# Altium project TK104_Pulsbegrenser_Eurorack.PrjPCB
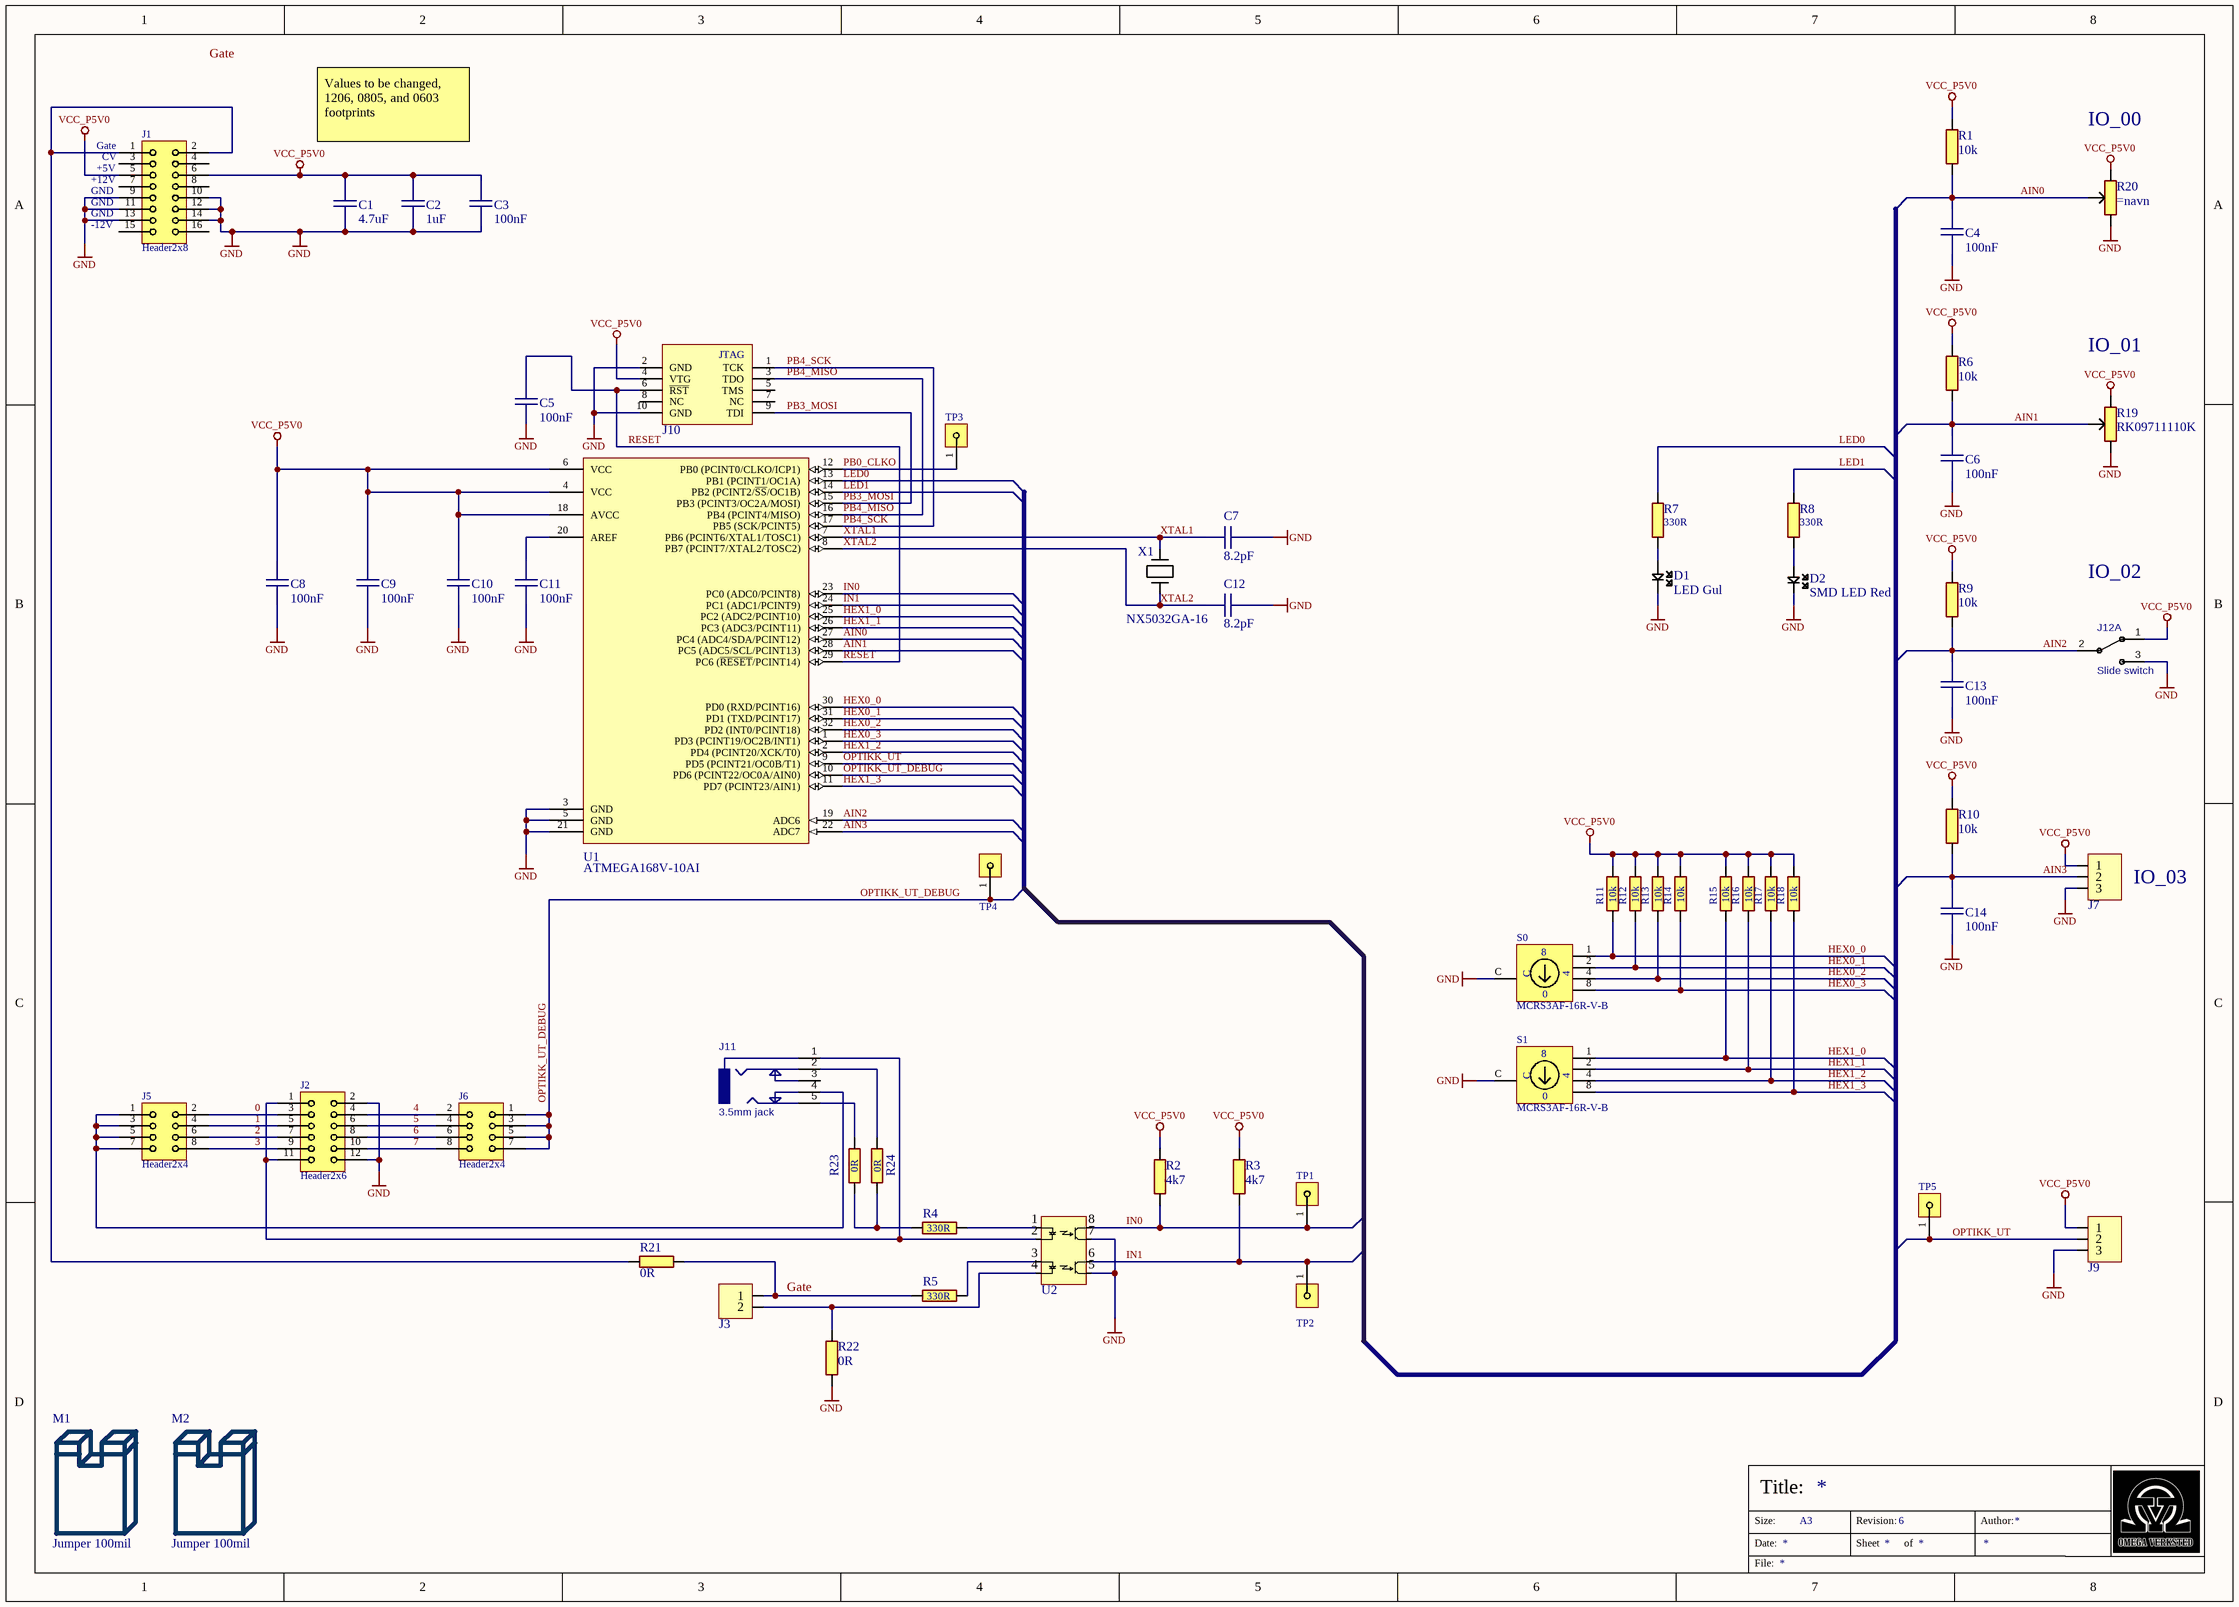
[diagram p0: TK104_Pulsbegrenser_Eurorack.SchDoc]
1 sheet, 62 parts. Net scope: global (net labels, ports and power ports of the same name join across sheets).
Board file: TK104_Pulsbegrenser_Eurorack.PcbDoc

## Sheet TK104_Pulsbegrenser_Eurorack.SchDoc
size A3; Revision: 6

### Parts
C1  4.7uF  [CAPC1206(3216)170_N]
C2  1uF  [CAPC0805(2012)100_N]
C3  100nF  [CAPC0603(1608)55_N]
C4  100nF  [CAPC0603(1608)55_N]
C5  100nF  [CAPC0603(1608)55_N]
C6  100nF  [CAPC0603(1608)55_N]
C7  8.2pF  [CAPC0603(1608)55_N]
C8  100nF  [CAPC0603(1608)55_N]
C9  100nF  [CAPC0603(1608)55_N]
C10  100nF  [CAPC0603(1608)55_N]
C11  100nF  [CAPC0603(1608)55_N]
C12  8.2pF  [CAPC0603(1608)55_N]
C13  100nF  [CAPC0603(1608)55_N]
C14  100nF  [CAPC0603(1608)55_N]
D1  LED Gul  [LED254W7L870D500]
D2  SMD LED Red  [I_LEDC0603(1608)_N]
J1  Header2x8  [HDRV16W64P254_2X8_Shrouded]
J2  Header2x6  [HDRV12W64P254_2X6_RA]
J3  JST 2pin  [JST_2P]  (value not drawn)
J5  Header2x4  [HDRV8W64P254_2X4]
J6  Header2x4  [HDRV8W64P254_2X4]
J7  JST 3pin  [JST_3P]  (value not drawn)
J9  JST 3pin  [JST_3P]  (value not drawn)
J10  Header SMD 127 2x5  [SMDHDRV10P127_2X5_615X330X560B]  (value not drawn)
J11  3.5mm jack  [PJ-306M]
J12  Slide switch  [1MS1T2B4M7RE]  (part A of 2)
M1  Jumper 100mil  [SNT-100-BK-T]
M2  Jumper 100mil  [SNT-100-BK-T]
R1  10k  [RESC0603(1608)_N]
R2  4k7  [RESC0603(1608)_N]
R3  4k7  [RESC0603(1608)_N]
R4  330R  [RESC0603(1608)_N]
R5  330R  [RESC0603(1608)_N]
R6  10k  [RESC0603(1608)_N]
R7  330R  [RESC0603(1608)_N]
R8  330R  [RESC0603(1608)_N]
R9  10k  [RESC0603(1608)_N]
R10  10k  [RESC0603(1608)_N]
R11  10k  [RESC0603(1608)_N]
R12  10k  [RESC0603(1608)_N]
R13  10k  [RESC0603(1608)_N]
R14  10k  [RESC0603(1608)_N]
R15  10k  [RESC0603(1608)_N]
R16  10k  [RESC0603(1608)_N]
R17  10k  [RESC0603(1608)_N]
R18  10k  [RESC0603(1608)_N]
R19  RK09711110K  [RK09711110K]
R20  (no value)  [PTA4543-ANGLE]
R21  0R  [RESC0603(1608)_N]
R22  0R  [RESC0603(1608)_N]
R23  0R  [RESC0603(1608)_N]
R24  0R  [RESC0603(1608)_N]
S0  MCRS3AF-16R-V-B  [MCRS3AF-16R-V-B]
S1  MCRS3AF-16R-V-B  [MCRS3AF-16R-V-B]
TP1  Header1x1  [HDRV1W64P254_1X1_254X254X900B]  (value not drawn)
TP2  Header1x1  [HDRV1W64P254_1X1_254X254X900B]  (value not drawn)
TP3  Header1x1  [HDRV1W64P254_1X1_254X254X900B]  (value not drawn)
TP4  Header1x1  [HDRV1W64P254_1X1_254X254X900B]  (value not drawn)
TP5  Header1x1  [HDRV1W64P254_1X1_254X254X900B]  (value not drawn)
U1  ATMEGA168V-10AI  [TQFP80P900X900X120-32N]
U2  Dual_Optocoupler  [SOIC127P590X363-8N]  (value not drawn)
X1  NX5032GA-16  [CRYSTAL-ABM7]

### Nets
GND: C1.1 C2.1 C3.1 C4.1 C5.1 C6.1 C7.1 C8.2 C9.2 C10.1 C11.1 C12.1 C13.1 C14.1 D1.2 D2.2 J1.9 J1.10 J1.11 J1.12 J1.13 J1.14 J2.2 J2.12 J7.3 J9.3 J10.2(GND) J10.10(GND) J12.3 R19.1 R20.3 R22.1 S0.C S1.C U1.3(GND) U1.5(GND) U1.21(GND) U2.5 U2.7
VCC_P5V0: C1.2 C2.2 C3.2 C8.1 C9.1 C10.2 J1.5 J1.6 J7.1 J9.1 J10.4(VTG) J12.1 R1.2 R2.2 R3.2 R6.2 R9.2 R10.2 R11.2 R12.2 R13.2 R14.2 R15.2 R16.2 R17.2 R18.2 R19.3 R20.1 U1.4(VCC) U1.6(VCC) U1.18(AVCC)
0: J2.3 J5.2
1: J2.5 J5.4
2: J2.7 J5.6
3: J2.9 J5.8
4: J2.4 J6.2
5: J2.6 J6.4
6: J2.8 J6.6
7: J2.10 J6.8
AIN0: C4.2 R1.1 R20.2 U1.27(PC4_(ADC4/SDA/PCINT12))
AIN1: C6.2 R6.1 R19.2 U1.28(PC5_(ADC5/SCL/PCINT13))
AIN2: C13.2 J12.2 R9.1 U1.19(ADC6)
AIN3: C14.2 J7.2 R10.1 U1.22(ADC7)
Gate: J3.1 R5.1 R21.2
HEX0_0: R11.1 S0.1 U1.30(PD0_(RXD/PCINT16))
HEX0_1: R12.1 S0.2 U1.31(PD1_(TXD/PCINT17))
HEX0_2: R13.1 S0.4 U1.32(PD2_(INT0/PCINT18))
HEX0_3: R14.1 S0.8 U1.1(PD3_(PCINT19/OC2B/INT1))
HEX1_0: R15.1 S1.1 U1.25(PC2_(ADC2/PCINT10))
HEX1_1: R16.1 S1.2 U1.26(PC3_(ADC3/PCINT11))
HEX1_2: R17.1 S1.4 U1.2(PD4_(PCINT20/XCK/T0))
HEX1_3: R18.1 S1.8 U1.11(PD7_(PCINT23/AIN1))
IN0: R2.1 TP1.1 U1.23(PC0_(ADC0/PCINT8)) U2.8
IN1: R3.1 TP2.1 U1.24(PC1_(ADC1/PCINT9)) U2.6
LED0: R7.2 U1.13(PB1_(PCINT1/OC1A))
LED1: R8.2 U1.14(PB2_(PCINT2/~{SS}/OC1B))
OPTIKK_UT: J9.2 TP5.1 U1.9(PD5_(PCINT21/OC0B/T1))
OPTIKK_UT_DEBUG: J6.1 J6.3 J6.5 J6.7 TP4.1 U1.10(PD6_(PCINT22/OC0A/AIN0))
PB0_CLKO: TP3.1 U1.12(PB0_(PCINT0/CLKO/ICP1))
PB3_MOSI: J10.9(TDI) U1.15(PB3_(PCINT3/OC2A/MOSI))
PB4_MISO: J10.3(TDO) U1.16(PB4_(PCINT4/MISO))
PB4_SCK: J10.1(TCK) U1.17(PB5_(SCK/PCINT5))
RESET: C5.2 J10.6(~{RST}) U1.29(PC6_(~{RESET}/PCINT14))
XTAL1: C7.2 U1.7(PB6_(PCINT6/XTAL1/TOSC1)) X1.1
XTAL2: C12.2 U1.8(PB7_(PCINT7/XTAL2/TOSC2)) X1.2
NetC11_2: C11.2 U1.20(AREF)
NetD1_1: D1.1 R7.1
NetD2_1: D2.1 R8.1
NetJ1_1: J1.1 J1.2 R21.1
NetJ2_1: J2.1 J2.11 J11.1 U2.2
NetJ3_2: J3.2 R22.2 U2.4
NetJ5_1: J5.1 J5.3 J5.5 J5.7 J11.4
NetJ11_2: J11.2 R24.2
NetJ11_5: J11.5 R23.2
NetR4_1: R4.1 R23.1 R24.1
NetR4_2: R4.2 U2.1
NetR5_2: R5.2 U2.3

Not connected (* = marked no-connect by the designer): J1 3 4 7 8 15 16; J10 5(TMS) 7(NC) 8(NC); J11 3

### Notes on the sheet
- (near R20) IO_00
- (near J1) GND
- (near J1) +12V
- (near J1) +5V
- (near J1) Gate
- (near J1) CV
- Values to be changed, 1206, 0805, and 0603 footprints
- (near J1) -12V
- (near R19) IO_01
- (near J12) IO_02
- (near J7) IO_03
- Labels drawn without touching a wire or pin: Gate
- Size:
- Date:
- Title:
- A3
- Revision:
- Sheet
- of
- Author:
- File:
- (in symbol 3765) 0

### Library data of the parts
C1 = 2992: X7R 50V; id: 2992; pakke_opprettet_av: 815; pakke_opprettet: 11.02.2015 13.21.22; symbol_opprettet: 14.11.2014 20.19.34; pris: 1; nokkelord: Kondensator, capacitor; produsent: Multikomp; pakketype: 1206; symbol_opprettet_av: 815; navn: 4.7uF
C2 = 3582: X7R 50V 10%; id: 3582; pakke_opprettet_av: 815; pakke_opprettet: 14.11.2014 20.52.01; symbol_opprettet: 14.11.2014 20.19.34; leverandor_varenr: 1735541; pris: 4; nokkelord: Kondensator, capacitor; produsent: Murata; leverandor: Farnell; pakketype: 0805; symbol_opprettet_av: 815; navn: 1uF
C3 C4 C6 C13 C14 = 3028: X7R 50V 5%; id: 3028; pakke_opprettet_av: 815; pakke_opprettet: 18.02.2015 14.18.13; symbol_opprettet: 14.11.2014 20.19.34; leverandor_varenr: 1759122; pris: 1; nokkelord: Kondensator, Capacitor, CAP; produsent: Multikomp; leverandor: Farnell; pakketype: 0603; symbol_opprettet_av: 815; navn: 100nF
C5 C8-C11 = 3028: X7R 50V 5%; id: 3028; pakke_opprettet_av: 815; leverandor_varenr: 1759122; pris: 1; nokkelord: Kondensator, Capacitor, CAP; produsent: Multikomp; leverandor: Farnell; pakketype: 0603; pakke_opprettet: 18.02.2015 14:18:13; symbol_opprettet_av: 815; symbol_opprettet: 14.11.2014 20:19:34; navn: 100nF
C7 C12 = 3032: NP0 50V 5%; id: 3032; pakke_opprettet_av: 815; leverandor_varenr: 2434642; pris: 1; nokkelord: Kondensator, Capacitor, CAP; produsent: Murata; leverandor: Farnell; pakketype: 0603; pakke_opprettet: 18.02.2015 14:18:13; symbol_opprettet_av: 815; symbol_opprettet: 14.11.2014 20:19:34; navn: 8.2pF
D1 = 4054: id: 4054; rad: 4; rom: GM; lager_type: Baklager; hylle: 0; antall: 500; pakke_opprettet_av: 1366; symbol_opprettet_av: 815; beskrivelse: Farget/diffuse LED, 5mm; pris: 1; nokkelord: LED, gul, yellow, 5mm, diode, lys, light,  led 5mm; dybde: 4; kolonne: 0; pakke_opprettet: 2016-02-09 18:21:00; symbol_opprettet: 2014-07-06 18:59:47; navn: LED Gul; produsent: -; pakketype: -
D2 = 2209: id: 2209; rad: 0; rom: OV; lager_type: Fremlager; dybde: 2; hylle: 13; antall: 50; pakke_opprettet_av: 815; pakke_opprettet: 06.07.2014 18.55.44; symbol_opprettet: 06.07.2014 18.59.47; leverandor_varenr: 8554641; pris: 1; produsent: Avago; leverandor: Farnell; pakketype: 0603; kolonne: 0; symbol_opprettet_av: 815; beskrivelse: SMD; navn: SMD LED Red; nokkelord: SMD
J1 = 4645: id: 4645; pakke_opprettet_av: 815; beskrivelse: Header; navn: Header Shrouded 2X8P; pris: 10; pakketype: TH; pakke_opprettet: 2019-02-14 23:39:48; symbol_opprettet_av: 815; symbol_opprettet: 2014-11-13 11:08:32; nokkelord: Header
J2 = 4651: id: 4651; pakke_opprettet_av: 815; beskrivelse: Header; navn: Header 2X6 Right Angle; pris: 6; pakketype: TH; pakke_opprettet: 2019-02-16 14:15:04; symbol_opprettet_av: 815; symbol_opprettet: 2014-11-13 11:04:02; nokkelord: Header
J3 = 2227: pris pr. stk.; id: 2227; pakke_opprettet_av: 815; pris: 2; nokkelord: Connector, Kontakt; pakketype: TH; pakke_opprettet: 28.06.2014 18:25:03; symbol_opprettet_av: 815; symbol_opprettet: 28.06.2014 15:33:17; navn: JST 2pin
J5 J6 = 4648: id: 4648; pakke_opprettet_av: 815; beskrivelse: Header; pris: 4; pakketype: TH; pakke_opprettet: 2019-02-16 12:01:43; symbol_opprettet_av: 815; symbol_opprettet: 2014-11-13 11:03:49; navn: Header 2X4; nokkelord: Header
J7 J9 = 2226: pris pr. stk.; id: 2226; pakke_opprettet_av: 815; pris: 2; nokkelord: Connector, Kontakt; pakketype: TH; pakke_opprettet: 28.06.2014 18:25:12; symbol_opprettet_av: 815; symbol_opprettet: 28.06.2014 15:33:24; navn: JST 3pin
J10 = 2449: 1,27mm Pitch SMD Header; id: 2449; pakke_opprettet_av: 815; pris: 20; nokkelord: JTAG; pakke_opprettet: 15.11.2014 18:30:38; symbol_opprettet_av: 815; symbol_opprettet: 15.11.2014 18:33:29; navn: Header SMD 127 2x5; pakketype: SMD
J11 = 3885: 5-pin 3.5mm 1/8" Stereo Jack PCB Panel Mount; id: 3885; rad: 0; rom: GM; lager_type: Baklager; dybde: 6; antall: 100; pakke_opprettet_av: 1335; pris: 5; pakketype: TH; hylle: 0; kolonne: 0; pakke_opprettet: 2016-11-16 18:13:13; symbol_opprettet_av: 1335; symbol_opprettet: 2016-11-16 18:31:54; beskrivelse: PCB panel mount; navn: 3.5mm jack
J12 = 4622: Toggle Switch SPDT On-On; id: 4622; pakke_opprettet_av: 815; symbol_opprettet_av: 1335; leverandor_varenr: 9473297; pris: 36; nokkelord: 1M Series; produsent: Multicomp; leverandor: Farnell; pakketype: TH; pakke_opprettet: 2019-02-12 23:53:13; symbol_opprettet: 2017-02-20 18:08:19; navn: 1MS1T2B4M7RE
M1 M2 = 4649: id: 4649; pakke_opprettet_av: 815; beskrivelse: Jumper for 2.54mm pitch header; pris: 1; nokkelord: jumper, lask; LIBREFERENCE: Jumper; pakke_opprettet: 2019-02-16 12:16:49; symbol_opprettet_av: 815; symbol_opprettet: 2019-02-16 13:11:13; navn: Jumper 100mil; pakketype: -
R1 R6 R9-R18 = 2444: 0.1W 1% Thick film resistor; id: 2444; rad: -1; rom: OV; lager_type: Fremlager; dybde: 72; hylle: 6; antall: 100; kolonne: 0; pakke_opprettet_av: 815; pakke_opprettet: 08.07.2014 21.15.30; symbol_opprettet: 08.07.2014 21.16.33; leverandor_varenr: 2447230; nokkelord: Resistor Motstand; produsent: Multikomp; leverandor: Farnell; pakketype: 0603; symbol_opprettet_av: 815; navn: 10k; pris: 0
R2 R3 = 3457: 0.1W 1% Thick film resistor; id: 3457; rad: -1; rom: OV; lager_type: Fremlager; dybde: 64; hylle: 2; antall: 100; kolonne: 0; pakke_opprettet_av: 815; pakketype: 0603; pakke_opprettet: 2014-07-08 21:15:30; symbol_opprettet_av: 815; symbol_opprettet: 2014-07-08 21:16:33; navn: 4k7; pris: 0
R4 R5 R7 R8 = 2448: 0.1W 1% Thick film resistor; id: 2448; rad: -1; rom: OV; lager_type: Fremlager; dybde: 36; hylle: 6; antall: 100; kolonne: 0; pakke_opprettet_av: 815; pakke_opprettet: 08.07.2014 21.15.30; symbol_opprettet: 08.07.2014 21.16.33; nokkelord: Resistor Motstand; pakketype: 0603; symbol_opprettet_av: 815; navn: 330R; pris: 0
R19 = 4652: 10k linear pot 1 turn; id: 4652; pakke_opprettet_av: 815; leverandor_varenr: 1191710; pris: 45; nokkelord: potmeter, pot; produsent: Alps; leverandor: Farnell; pakketype: TH; pakke_opprettet: 2019-02-16 15:55:44; symbol_opprettet_av: 815; symbol_opprettet: 2016-11-03 15:34:07; navn: RK09711110K
R20 = Potmeter: Farnell: 1688415
R21-R24 = 3186: 0.1W 1% Thick film resistor; id: 3186; pakke_opprettet_av: 815; pris: 0; nokkelord: Resistor Motstand Jumper Lask; produsent: Multikomp; pakketype: 0603; pakke_opprettet: 2014-07-08 21:15:30; symbol_opprettet_av: 815; symbol_opprettet: 2014-07-08 21:16:33; navn: 0R
S0 S1 = 3765: Rotary hex switch; id: 3765; pakke_opprettet_av: 815; pakke_opprettet: 16.09.2016 20.12.26; symbol_opprettet: 16.09.2016 20.35.40; leverandor_varenr: 2083018; pris: 13; nokkelord: encoder; produsent: Multikomp; leverandor: Farnell; pakketype: TH; symbol_opprettet_av: 815; navn: MCRS3AF-16R-V-B
TP1-TP5 = 2428: id: 2428; pakke_opprettet_av: 815; beskrivelse: 2,54mm pitch; pris: 1; pakketype: TH; pakke_opprettet: 13.11.2014 12:30:32; symbol_opprettet_av: 815; symbol_opprettet: 13.11.2014 10:58:46; navn: Header 1x1
U1 = 2242: id: 2242; rad: 1; rom: OV; lager_type: Fremlager; dybde: 2; antall: 100; kolonne: 3; pakke_opprettet_av: 1335; beskrivelse: Mikrokontroller; pris: 0; produsent: Atmel; pakketype: TQFP; hylle: 1; pakke_opprettet: 11.03.2016 13:28:05; symbol_opprettet_av: 1335; symbol_opprettet: 11.03.2016 13:26:28; navn: ATMEGA168V-10AI
U2 = 2379: Dual Optocoupler; id: 2379; pakke_opprettet_av: 774; symbol_opprettet_av: 815; leverandor_varenr: 1086672; navn: MOCD207R2M; pris: 4; produsent: Fairchild; leverandor: Farnell; pakketype: SOIC; pakke_opprettet: 23.08.2014 14:54:32; symbol_opprettet: 28.06.2014 15:40:47
X1 = 1594: Crystal 16 MHz; id: 1594; rad: 0; rom: OV; lager_type: Fremlager; dybde: 1; hylle: 2; antall: 42; kolonne: 3; pakke_opprettet_av: 774; leverandor_varenr: 644-1135-1-ND; pris: 5; nokkelord: xtal, oscillator; produsent: NDK; leverandor: DigiKey; pakketype: SMD; pakke_opprettet: 23.08.2014 20:10:40; symbol_opprettet_av: 774; symbol_opprettet: 23.08.2014 20:23:20; navn: NX5032GA-16